# EAGLE design CarBee v1.1 (EAGLE 6.5.0)
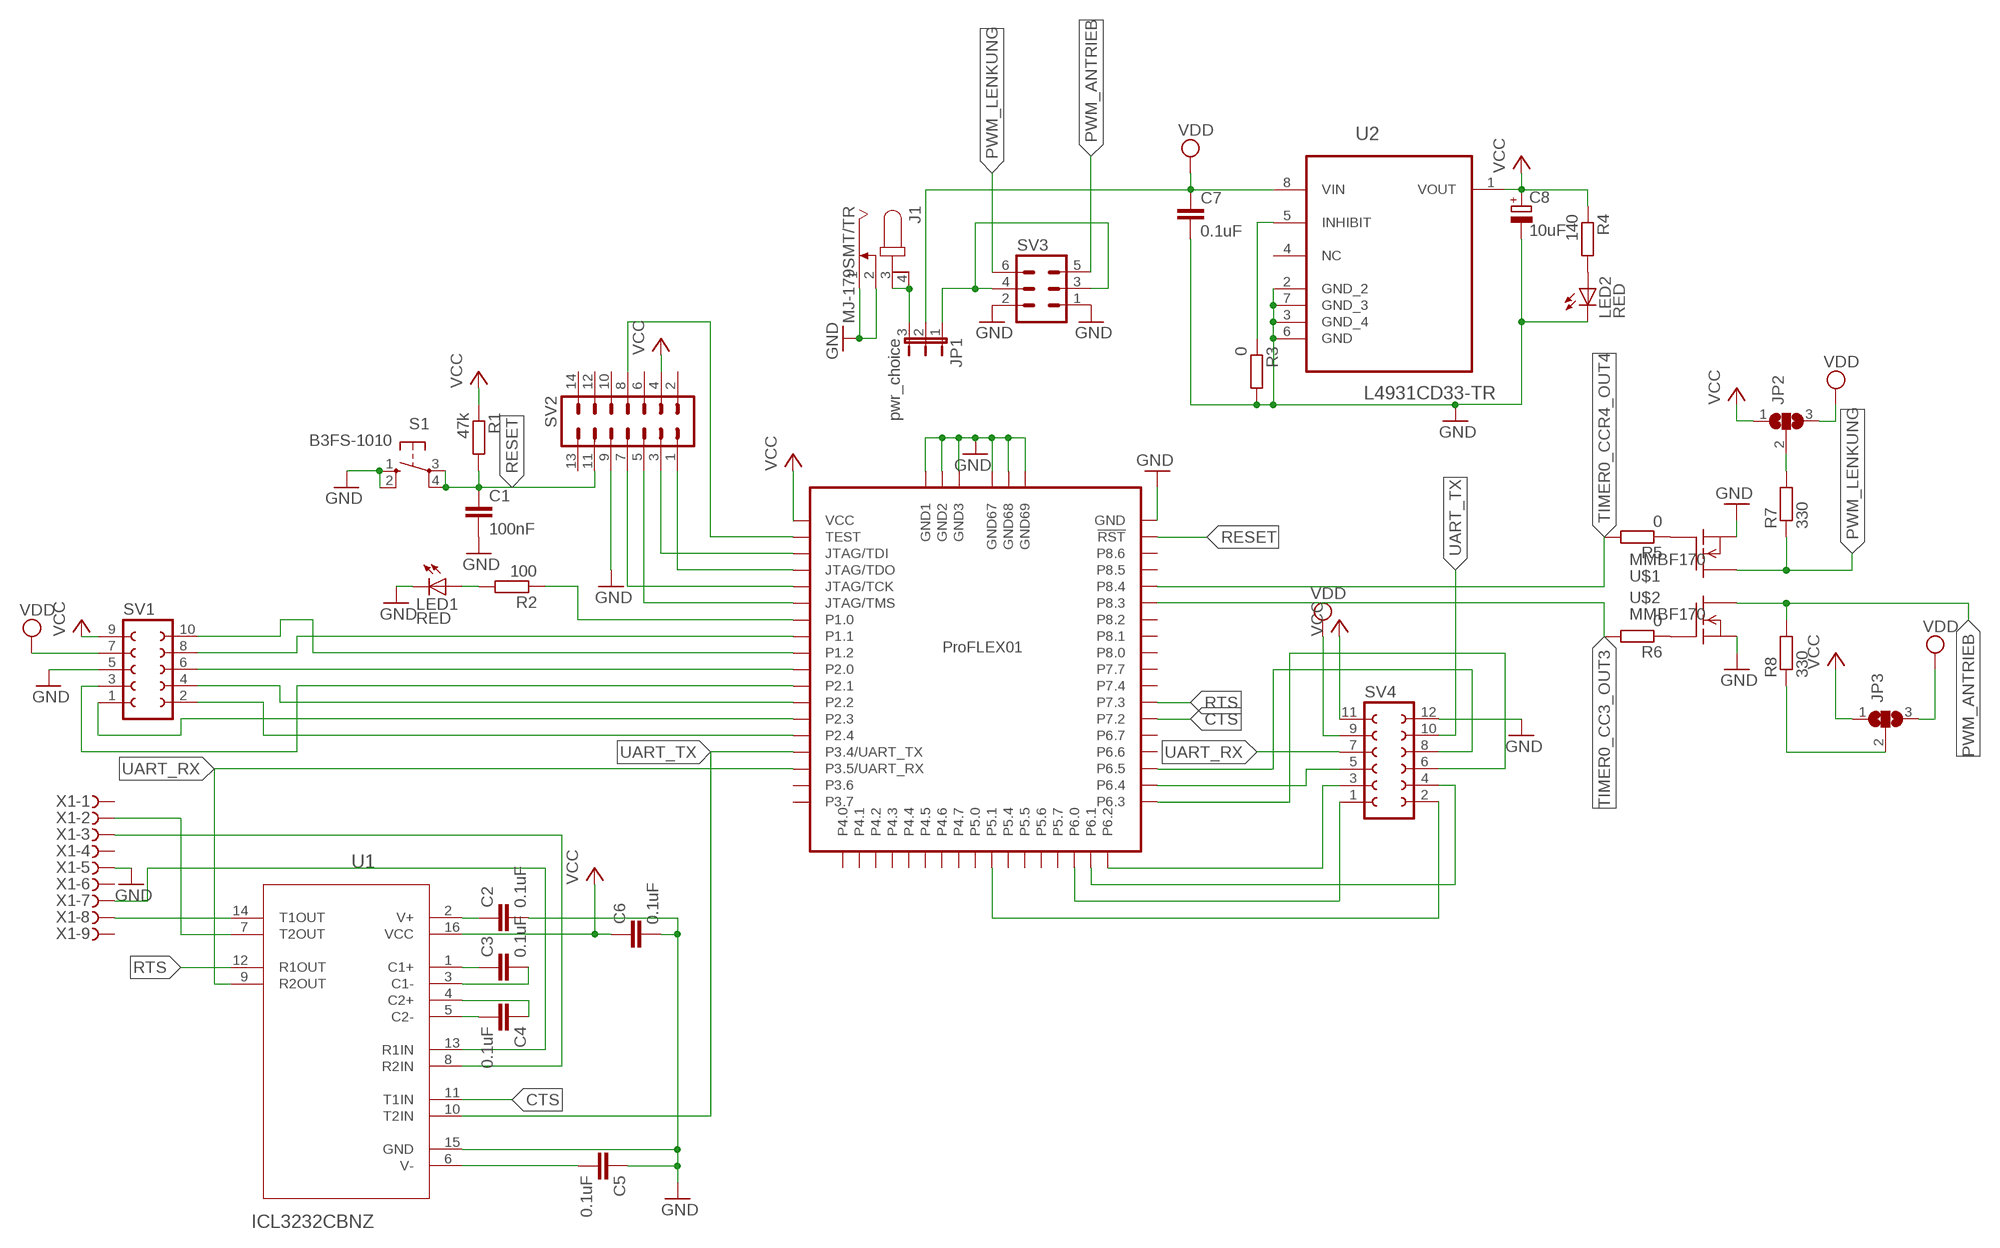
[diagram p0: schematic, sheet 1]

## Parts
C1  100nF  C-EUC0603  [C0603]
C2  0.1uF  C-EUC0603  [C0603]
C3  0.1uF  C-EUC0603  [C0603]
C4  0.1uF  C-EUC0603  [C0603]
C5  0.1uF  C-EUC0603  [C0603]
C6  0.1uF  C-EUC0603  [C0603]
C7  0.1uF  C-EUC0603  [C0603]
C8  10uF  CPOL-EU  [PANASONIC_B]
J1  MJ-179SMT/TR  [MJ-179SMT]
JP1  pwr_choice  JP2E  [JP2]
JP2  SJ2W  [SJ_2]
JP3  SJ2W  [SJ_2]
LED1  RED  LEDCHIP-LED0603  [CHIP-LED0603]
LED2  RED  LEDCHIP-LED0603  [CHIP-LED0603]
MOD1  PROFLEX01  [MODFLEX01]
R1  47k  R-EU_R0603  [R0603]
R2  100  R-EU_R0603  [R0603]
R3  0  R-EU_R0603  [R0603]
R4  140  R-EU_R0603  [R0603]
R5  0  R-EU_R0603  [R0603]
R6  0  R-EU_R0603  [R0603]
R7  330  R-EU_R0603  [R0603]
R8  330  R-EU_R0603  [R0603]
S1  B3FS-1010  [B3FS-1010]
SV1  FE05-2  [FE05-2]
SV2  ML14  [ML14]
SV3  MA03-2  [MA03-2]
SV4  FE06-2  [FE06-2]
U1  ICL3232CBNZ  [SOIC127P600X175-16N]
U2  L4931CD33-TR  [SOIC127P600X175-8N]
U$1  MMBF170  [SOT23]
U$2  MMBF170  [SOT23]
X1  F09HPS  [F09HP]

## Nets
CTS: MOD1.P$37(P7.2) U1.11(T1IN)
GND: C1.2 C2.2 C5.1 C6.2 C7.2 C8.- J1.1 J1.2 LED1.C LED2.C MOD1.P$1(GND1) MOD1.P$2(GND2) MOD1.P$3(GND3) MOD1.P$44(GND) MOD1.P$67(GND67) MOD1.P$68(GND68) MOD1.P$69(GND69) R3.2 S1.1(S) S1.2(S1) SV1.5 SV2.9 SV3.1 SV3.2 SV4.12 U1.15(GND) U2.2(GND_2) U2.3(GND_4) U2.6(GND) U2.7(GND_3) U$1.2(S) U$2.2(S) X1.5
N$1: MOD1.P$13(TEST) SV2.8
N$2: LED2.A R4.2
N$3: MOD1.P$55(P2.4) SV1.2
N$5: MOD1.P$21(P6.4) SV4.5
N$6: MOD1.P$52(P2.1) SV1.3
N$7: U1.8(R2IN) X1.3
N$8: C3.1 U1.1(C1+)
N$9: C3.2 U1.3(C1-)
N$10: MOD1.P$16(P5.1) SV4.2
N$11: C4.1 U1.4(C2+)
N$12: C2.1 U1.2(V+)
N$13: C5.2 U1.6(V-)
N$15: J1.3 J1.4 JP1.3
N$16: JP2.2 R7.2
N$17: MOD1.P$51(P2.0) SV1.6
N$18: MOD1.P$19(P6.2) SV4.3
N$19: MOD1.P$18(P6.1) SV4.4
N$20: MOD1.P$20(P6.3) SV4.6
N$21: MOD1.P$22(P6.5) SV4.8
N$22: MOD1.P$17(P6.0) SV4.1
N$25: MOD1.P$49(P1.0) R2.1
N$26: LED1.A R2.2
N$27: MOD1.P$53(P2.2) SV1.4
N$28: U1.14(T1OUT) X1.8
N$29: MOD1.P$50(P1.1) SV1.8
N$30: U1.13(R1IN) X1.7
N$31: U1.7(T2OUT) X1.2
N$32: MOD1.P$47(P1.2) SV1.10
N$33: JP1.1 SV3.3 SV3.4
N$35: R5.1 U$1.1(G)
N$36: R6.1 U$2.1(G)
N$37: R3.1 U2.5(INHIBIT)
N$51: MOD1.P$54(P2.3) SV1.1
N$59: MOD1.P$12(JTAG/TDO) SV2.1
N$60: MOD1.P$10(JTAG/TDI) SV2.3
N$61: MOD1.P$9(JTAG/TMS) SV2.5
N$62: MOD1.P$11(JTAG/TCK) SV2.7
N$65: C4.2 U1.5(C2-)
N$66: JP3.2 R8.1
PWM_ANTRIEB: R8.2 SV3.5 U$2.3(D)
PWM_LENKUNG: R7.1 SV3.6 U$1.3(D)
RESET: C1.1 MOD1.P$14(!RST) R1.2 S1.3(P) S1.4(P1) SV2.11
RTS: MOD1.P$38(P7.3) U1.12(R1OUT)
TIMER0_CC3_OUT3: MOD1.P$42(P8.3) R6.2
TIMER0_CCR4_OUT4: MOD1.P$41(P8.4) R5.2
UART_RX: MOD1.P$36(P3.5/UART_RX) SV4.7 U1.9(R2OUT)
UART_TX: MOD1.P$35(P3.4/UART_TX) SV4.10 U1.10(T2IN)
VCC: C6.1 C8.+ JP2.1 JP3.1 MOD1.P$26(VCC) R1.1 R4.1 SV1.9 SV2.4 SV4.11 U1.16(VCC) U2.1(VOUT)
VDD: C7.1 JP1.2 JP2.3 JP3.3 SV1.7 SV4.9 U2.8(VIN)
Unconnected: MOD1.P$15(P5.0) MOD1.P$23(P6.6) MOD1.P$24(P6.7) MOD1.P$25(P7.4) MOD1.P$27(P4.7) MOD1.P$28(P4.6) MOD1.P$29(P4.5) MOD1.P$30(P4.4) MOD1.P$31(P4.3) MOD1.P$32(P4.2) MOD1.P$33(P4.1) MOD1.P$34(P4.0) MOD1.P$39(P8.6) MOD1.P$40(P8.5) MOD1.P$43(P8.2) MOD1.P$45(P8.1) MOD1.P$46(P8.0) MOD1.P$48(P7.7) MOD1.P$56(P5.4) MOD1.P$57(P3.7) MOD1.P$58(P5.5) MOD1.P$59(P3.6) MOD1.P$60(P5.7) MOD1.P$61(P5.6) SV2.2 SV2.6 SV2.10 SV2.12 SV2.13 SV2.14 U2.4(NC) X1.1 X1.4 X1.6 X1.9

## Library data of the parts
C1 C3 C6 = rcl:C-EU: CAPACITOR, European symbol; MPN: 0306ZC104KAT2A; OC_NEWARK: 96M1106
C2 C4 C5 C7 = rcl:C-EU: CAPACITOR, European symbol; OC_NEWARK: unknown
C8 = AudioRacer:CPOL-EU; OC_NEWARK: unknown
J1 = AudioRacer:MJ-179SMT/TR: MULTICOMP - MJ-179SMT - BUCHSE LEITERPLATTE SMD PIN 2MM http://de.farnell.com/multicomp/mj-179smt/buchse-leiterplatte-smd-pin-2mm/dp/1737262?Ntt=173-7262 http://www.farnell.com/cad/1174249.pdf http://www.farnell.com/datasheets/1671560.pdf
JP1 = jumper:JP2E: JUMPER; OC_NEWARK: unknown
JP2 JP3 = jumper:SJ2W: SMD solder JUMPER; OC_NEWARK: unknown
LED1 LED2 = led:LED: LED OSRAM: - CHIPLED LG R971, LG N971, LY N971, LG Q971, LY Q971, LO R971, LY R971 LH N974, LH R974 LS Q976, LO Q976, LY Q976 LO Q996 - Hyper CHIPLED LW Q18S LB Q993, LB Q99A, LB R99A - SideLED LS A670, LO A670, LY A670, LG A670, LP A670 LB A673, LV A673, LT A673, LW A673 LH A674 LY A675 LS A676, LA A676, LO A676, LY A676, LW A676 LS A679, LY A679, LG A679 - Hyper Micro SIDELED® LS Y876, LA Y876, LO Y876, LY Y876 LT Y87S - SmartLED LW L88C, LW L88S LB L89C, LB L89S, LG L890 LS L89K, LO L89K, LY L89K LS L896, LA L896, LO L896, LY L896 - TOPLED LS T670, LO T670, LY T670, LG T670, LP T670 LSG T670, LSP T670, LSY T670, LOP T670, LYG T670 LG T671, LOG T671, LSG T671 LB T673, LV T673, LT T673, LW T673 LH T674 LS T676, LA T676, LO T676, LY T676, LB T676, LH T676, LSB T676, LW T676 LB T67C, LV T67C, LT T67C, LS T67K, LO T67K, LY T67K, LW E67C LS E67B, LA E67B, LO E67B, LY E67B, LB E67C, LV E67C, LT E67C LW T67C LS T679, LY T679, LG T679 LS T770, LO T770, LY T770, LG T770, LP T770 LB T773, LV T773, LT T773, LW T773 LH T774 LS E675, LA E675, LY E675, LS T675 LS T776, LA T776, LO T776, LY T776, LB T776 LHGB T686 LT T68C, LB T68C - Hyper Mini TOPLED® LB M676 - Mini TOPLED Santana® LG M470 LS M47K, LO M47K, LY M47K Source: http://www.osram.convergy.de LUXEON: - LUMILED® LXK2-PW12-R00, LXK2-PW12-S00, LXK2-PW14-U00, LXK2-PW14-V00 LXK2-PM12-R00, LXK2-PM12-S00, LXK2-PM14-U00 LXK2-PE12-Q00, LXK2-PE12-R00, LXK2-PE12-S00, LXK2-PE14-T00, LXK2-PE14-U00 LXK2-PB12-K00, LXK2-PB12-L00, LXK2-PB12-M00, LXK2-PB14-N00, LXK2-PB14-P00, LXK2-PB14-Q00 LXK2-PR12-L00, LXK2-PR12-M00, LXK2-PR14-Q00, LXK2-PR14-R00 LXK2-PD12-Q00, LXK2-PD12-R00, LXK2-PD12-S00 LXK2-PH12-R00, LXK2-PH12-S00 LXK2-PL12-P00, LXK2-PL12-Q00, LXK2-PL12-R00 Source: www.luxeon.com KINGBRIGHT: KA-3528ASYC Source: www.kingbright.com; OC_NEWARK: unknown
MOD1 = proflex01:PROFLEX01; OC_NEWARK: unknown
R1-R8 = rcl:R-EU_: RESISTOR, European symbol; OC_NEWARK: unknown
S1 = AudioRacer:B3FS-1010: B3FS-1010 http://www.components.omron.com/components/web/PDFLIB.nsf/0/7A04F73D25AF4A8785257201007DD542/$file/B3FS_1110.pdf
SV1 = con-lsta:FE05-2: FEMALE HEADER; OC_FARNELL: unknown; OC_NEWARK: unknown
SV2 = con-harting-ml:ML14: HARTING; OC_FARNELL: unknown; OC_NEWARK: unknown
SV3 = con-lstb:MA03-2: PIN HEADER; OC_FARNELL: unknown; OC_NEWARK: unknown
SV4 = con-lsta:FE06-2: FEMALE HEADER; OC_FARNELL: unknown; OC_NEWARK: unknown
U1 = AudioRacer:ICL3232CBNZ: RS-232 Transmitters/Receivers; MPN: ICL3232CBNZ; OC_FARNELL: 9663975; OC_NEWARK: 80K7124; PACKAGE: SOIC-16; SUPPLIER: INTERSIL
U2 = AudioRacer:L4931CD33-TR: Very low drop voltage regulators with inhibit; MPN: L4931CD33-TR; OC_FARNELL: 1094211; OC_NEWARK: 89K1316; PACKAGE: SOIC-8; SUPPLIER: STMICROELECTRONICS
U$1 U$2 = AudioRacer:MMBF170: FAIRCHILD SEMICONDUCTOR - MMBF170 - TRANSISTOR MOSFET SMD SOT 23 N KANAL http://de.farnell.com/fairchild-semiconductor/mmbf170/transistor-mosfet-smd-sot-23-n/dp/9845399?Ntt=984-5399 http://www.farnell.com/datasheets/694801.pdf
X1 = con-subd:F09?S: SUB-D; OC_FARNELL: unknown; OC_NEWARK: unknown

## Net classes
1 SRV_PWR: width 3.988 mm

## Board
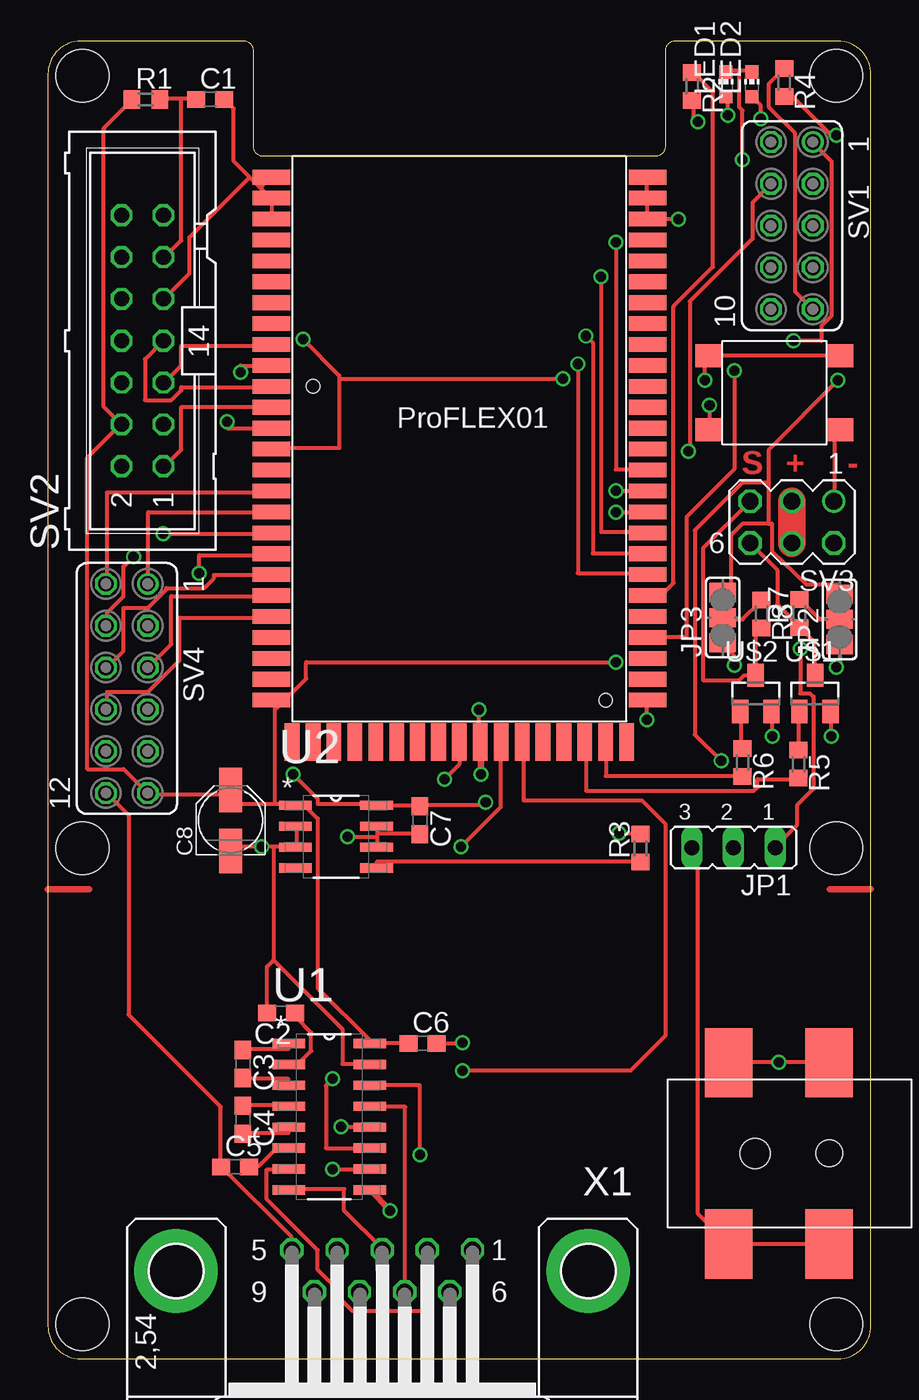
[diagram p1: board, top side]
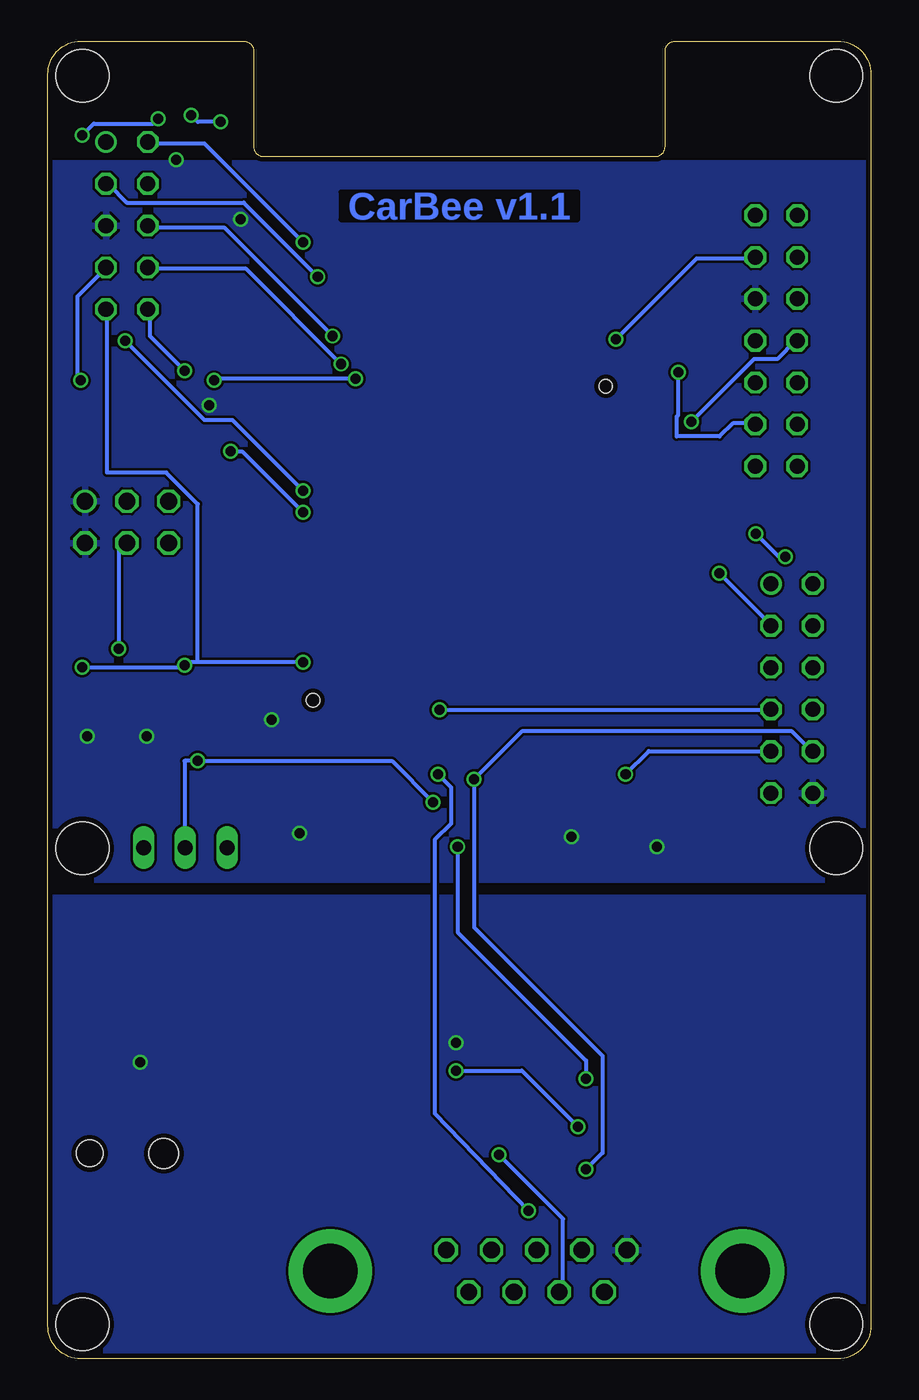
[diagram p2: board, bottom side, seen from below]

Size 50 x 80 mm. Coordinates in mm from the lower left corner, seen from the top.
Outline: 0,78 0,2 arc90 2,0 48,0 arc90 50,2 50,78 arc90 48,80 38.1,80 arc90 37.5,79.4 37.5,73.6 arc-90 36.9,73 13.1,73 arc-90 12.5,73.6 12.5,79.4 arc90 11.9,80 2,80 arc90 0,78
Copper layers (1*16): Top 0.035mm / dielectric 1.5mm / Bottom 0.035mm
Design rules "PCB-POOL Standard": minimum track width 0.15mm, minimum drill 0.3mm, track to track 0.15mm, track to pad 0.15mm, pad to pad 0.15mm, via to via 0.15mm, smd to smd 0.15mm, copper to edge 0.3mm, drill to drill 0.2mm, minimum pad ring 0.2mm, minimum via ring 0.15mm, stop-mask expansion 0.075mm, vias tented up to drill 0mil, thermal gap 0.2mm
Holes 3.2 mm at 47.9,77.9 2.1,77.9 47.9,2.1 2.1,2.1 47.9,31 2.1,31
tKeepout: 2 lines
bKeepout: 2 lines

### Footprints (pad centres in the part's own frame; a part is rotated, then mirrored left to right if it is on the bottom)
C0603 = smd 1.1 x 1: 1 -0.85,0; 2 0.85,0
PANASONIC_B = smd 2.7 x 1.4: + 1.85,0; - -1.85,0
MJ-179SMT = smd 2.9 x 4.2: 1 3.56,-5.5; 2 -2.54,-5.5; 3 3.56,5.5; 4 -2.54,5.5 | hole 1.6: -2.54,0 | hole 1.8: 1.96,0
JP2 = drill 0.914 long: 1 -2.54,0; 2 0,0; 3 2.54,0
SJ_2 = smd 1.168 x 1.6: 1 -1.524,0; 2 0,0; 3 1.524,0
CHIP-LED0603 = smd 0.8 x 0.8: A 0,-0.75; C 0,0.75
MODFLEX01 = smd 2.286 x 0.889: P$1 -11.43,16.51; P$2 -11.43,15.24; P$3 -11.43,13.97; P$4 -11.43,12.7; P$5 -11.43,11.43; P$6 -11.43,10.16; P$7 -11.43,8.89; P$8 -11.43,7.62; P$9 -11.43,6.35; P$10 -11.43,5.08; P$11 -11.43,3.81; P$12 -11.43,2.54; P$13 -11.43,1.27; P$14 -11.43,0; P$15 -11.43,-1.27; P$16 -11.43,-2.54; P$17 -11.43,-3.81; P$18 -11.43,-5.08; P$19 -11.43,-6.35; P$20 -11.43,-7.62; P$21 -11.43,-8.89; P$22 -11.43,-10.16; P$23 -11.43,-11.43; P$24 -11.43,-12.7; P$25 -11.43,-13.97; P$26 -11.43,-15.24; P$44 11.43,-15.24; P$45 11.43,-13.97; P$46 11.43,-12.7; P$47 11.43,-11.43; P$48 11.43,-10.16; P$49 11.43,-8.89; P$50 11.43,-7.62; P$51 11.43,-6.35; P$52 11.43,-5.08; P$53 11.43,-3.81; P$54 11.43,-2.54; P$55 11.43,-1.27; P$56 11.43,0; P$57 11.43,1.27; P$58 11.43,2.54; P$59 11.43,3.81; P$60 11.43,5.08; P$61 11.43,6.35; P$62 11.43,7.62; P$63 11.43,8.89; P$64 11.43,10.16; P$65 11.43,11.43; P$66 11.43,12.7; P$67 11.43,13.97; P$68 11.43,15.24; P$69 11.43,16.51 | smd 0.889 x 2.286: P$27 -10.16,-17.78; P$28 -8.89,-17.78; P$29 -7.62,-17.78; P$30 -6.35,-17.78; P$31 -5.08,-17.78; P$32 -3.81,-17.78; P$33 -2.54,-17.78; P$34 -1.27,-17.78; P$35 0,-17.78; P$36 1.27,-17.78; P$37 2.54,-17.78; P$38 3.81,-17.78; P$39 5.08,-17.78; P$40 6.35,-17.78; P$41 7.62,-17.78; P$42 8.89,-17.78; P$43 10.16,-17.78 | hole 0.8: 8.89,-15.24; -8.89,3.81
R0603 = smd 1 x 1.1: 1 -0.85,0; 2 0.85,0
B3FS-1010 = smd 1.6 x 1.4: 1 4,-2.25; 2 -4,-2.25; 3 4,2.25; 4 -4,2.25
FE05-2 = drill 0.914: 1 -5.08,1.27 | drill 0.914 octagon: 2 -5.08,-1.27; 3 -2.54,1.27; 4 -2.54,-1.27; 5 0,1.27; 6 0,-1.27; 7 2.54,1.27; 8 2.54,-1.27; 9 5.08,1.27; 10 5.08,-1.27
ML14 = drill 0.914 octagon: 1 -7.62,-1.27; 2 -7.62,1.27; 3 -5.08,-1.27; 4 -5.08,1.27; 5 -2.54,-1.27; 6 -2.54,1.27; 7 0,-1.27; 8 0,1.27; 9 2.54,-1.27; 10 2.54,1.27; 11 5.08,-1.27; 12 5.08,1.27; 13 7.62,-1.27; 14 7.62,1.27
MA03-2 = drill 1.016: 1 -2.54,-1.27 | drill 1.016 octagon: 2 -2.54,1.27; 3 0,-1.27; 4 0,1.27; 5 2.54,-1.27; 6 2.54,1.27
FE06-2 = drill 0.914: 1 -6.35,1.27 | drill 0.914 octagon: 2 -6.35,-1.27; 3 -3.81,1.27; 4 -3.81,-1.27; 5 -1.27,1.27; 6 -1.27,-1.27; 7 1.27,1.27; 8 1.27,-1.27; 9 3.81,1.27; 10 3.81,-1.27; 11 6.35,1.27; 12 6.35,-1.27
SOIC127P600X175-16N = smd 1.981 x 0.559: 1 -2.464,4.445; 2 -2.464,3.175; 3 -2.464,1.905; 4 -2.464,0.635; 5 -2.464,-0.635; 6 -2.464,-1.905; 7 -2.464,-3.175; 8 -2.464,-4.445; 9 2.464,-4.445; 10 2.464,-3.175; 11 2.464,-1.905; 12 2.464,-0.635; 13 2.464,0.635; 14 2.464,1.905; 15 2.464,3.175; 16 2.464,4.445
SOIC127P600X175-8N = smd 1.981 x 0.559: 1 -2.464,1.905; 2 -2.464,0.635; 3 -2.464,-0.635; 4 -2.464,-1.905; 5 2.464,-1.905; 6 2.464,-0.635; 7 2.464,0.635; 8 2.464,1.905
SOT23 = smd 1 x 1.4: 1 -0.95,-1.1; 2 0.95,-1.1; 3 0,1.1
F09HP = drill 1.016 octagon: 1 -5.486,-1.27; 2 -2.743,-1.27; 3 0,-1.27; 4 2.743,-1.27; 5 5.486,-1.27; 6 -4.115,1.27; 7 -1.372,1.27; 8 1.372,1.27; 9 4.115,1.27 | drill 3.302 pad 5.08: G1 -12.522,0; G2 12.522,0

### Placement (x,y rotation side)
C1  9.86,76.46 0 top
C2  14.16,21 180 top
C3  11.85,17.9 270 top
C4  11.86,14.51 270 top
C5  11.38,11.65 0 top
C6  22.77,19.15 0 top
C7  22.6,32.7 270 top
C8  11.1,32.69 90 top
J1  44.92,12.47 180 top
JP1  41.65,31.04 180 top
JP2  48.1,44.9 90 top
JP3  41,45 90 top
LED1  41.18,77.38 0 top
LED2  42.76,77.38 0 top
MOD1  25,55.23 0 top
R1  5.95,76.46 0 top
R2  39.13,77.26 270 top
R3  36,31 90 top
R4  44.73,77.48 270 top
R5  45.6,36.1 270 top
R6  42.2,36.2 270 top
R7  45.65,45.25 90 top
R8  43.35,45.23 270 top
S1  44.14,58.65 0 top
SV1  45.2,68.8 270 top
SV2  5.75,61.81 90 top
SV3  45.2,50.8 180 top
SV4  4.8,40.7 270 top
U1  17.1,14.7 0 top
U2  17.5,31.7 0 top
U$1  46.6,40.4 0 top
U$2  43,40.4 0 top
X1  20.31,5.33 180 top

### Tracks (layer width: path | path; a pad name or v marks a point on that pad's centre or on a via)
CTS  (via drill 0.61)
  Top 0.254: v17.3,17 16.9,16.6 16.9,12.8 19.5,12.8 U1.11 | v25.1,31.1 27.5,33.5 27.5,37.4 MOD1.P$37
  Bottom 0.254: v17.3,17 17.3,18.1 25.1,25.9 v25.1,31.1
GND  (via drill 0.61)
  Top 0.254: J1.1 41.4,18 v44.4,18 47.4,18 J1.2 | X1.5 14.8,6.6 14.8,7.4 10.6,11.6 C5.1 10.5,11.7 10.5,15.3 4.9,20.9 4.9,33 3.6,34.3 SV4.12 | 20,31.9 22.6,31.9 C7.2 | 20,31.9 20,32.3 U2.7 | 20,31.9 20,31.8 20,31.7 | 20,31.7 20,31.1 U2.6 19.9,31 | 19.6,17.8 U1.15 19.5,17.9 17.9,17.9 17.9,20 13.7,24.2 | U2.2 15.1,32.3 15.1,31.1 U2.3 15,31.1 13.7,31.1 | 13.7,31.1 v13,31.1 11.1,31.1 C8.- | 13.7,31.1 13.7,24.2 | 12.95,71.05 13.5,70.5 MOD1.P$2 13.6,70.4 13.6,69.2 MOD1.P$3 | 12.95,71.05 12.25,71.75 | 12.25,71.75 11.3,72.7 11.3,75.9 10.8,76.4 C1.2 | MOD1.P$1 13.5,71.7 13,71.2 13,71.1 12.95,71.05 | MOD1.P$69 36.4,71.7 36.4,70.5 MOD1.P$68 36.4,70.4 36.4,69.2 MOD1.P$67 v38.3,69.2 | 42,78.2 42.7,78.2 LED2.C | 42,78.2 41.2,78.2 LED1.C | v34.7,31.9 36,31.9 R3.2 | 42,78.2 42,76 42.2,75.8 v42.2,72.8 | v44,37.8 44,39.3 U$2.2 | v47.6,37.8 47.6,39.3 U$1.2 | v40.2,57.9 40.2,56.4 S1.2 | S1.1 48.1,56.4 47.8,56.1 47.8,52.1 SV3.1 | v36.4,38.8 36.4,39.9 MOD1.P$44 | 12.25,71.75 8.6,68.1 8.6,65.9 7.1,64.4 SV2.9 | C2.2 13.31,23.81 13.7,24.2 | C6.2 25.2,19.15 v25.2,19.2 | v18.2,31.7 20,31.7
  Bottom 0.254: v42.2,72.8 42.2,72.6
  pour Bottom: -2.3,72.6 51.1,72.6 51.1,29.1 -2.3,29.1
  pour Bottom: -2.3,28 53.7,28 53.7,-14.7 -2.3,-14.7
N$1  (via drill 0.61)
  Top 0.254: MOD1.P$13 10.9,56.5 v10.9,56.9
  Bottom 0.254: v10.9,56.9 7.1,60.7 5.7,60.7 4.6,61.8 4.5,61.8 SV2.8
N$2  (via drill 0.61)
  Top 0.254: v43.3,75.3 43.3,76.1 42.8,76.6 LED2.A | v47.9,74.3 47.6,74.3 45.3,76.6 44.8,76.6 R4.2
  Bottom 0.254: v43.3,75.3 43.6,75 47.2,75 v47.9,74.3
N$3  (via drill 0.61)
  Top 0.254: v34.5,67.8 34.5,54 36.4,54 MOD1.P$55
  Bottom 0.254: v34.5,67.8 40.5,73.8 43.9,73.8 SV1.2
N$5
  Top 0.254: SV4.5 7.5,43.4 7.5,46.3 13.5,46.3 MOD1.P$21
N$6  (via drill 0.61)
  Top 0.254: v33.6,65.7 33.6,50.2 36.4,50.2 MOD1.P$52
  Bottom 0.254: v33.6,65.7 38.1,70.2 45.2,70.2 46.3,71.3 46.4,71.3 SV1.3
N$7
  Top 0.254: U1.8 14.7,10.3 18,10.3 18,9 20.3,6.7 X1.3
N$8
  Top 0.254: C3.1 11.9,18.8 14.6,18.8 14.6,19.1 U1.1
N$9
  Top 0.254: C3.2 11.9,17 14.6,17 14.6,16.7 U1.3
N$10
  Top 0.254: MOD1.P$16 13.5,52.6 3.6,52.6 3.6,47.1 SV4.2
N$11
  Top 0.254: C4.1 11.9,15.4 14.6,15.4 U1.4
N$12
  Top 0.254: U1.2 14.7,17.9 15.2,17.9 16,18.7 16,19.8 15.01,20.79 C2.1
N$13
  Top 0.254: C5.2 12.3,11.7 12.8,11.7 13.8,12.7 14.6,12.7 U1.6
N$15
  Top 0.254: JP1.3 39.2,31 39.5,30.7 39.5,8.8 41.3,7 J1.3 41.4,7 47.4,7 J1.4
N$16
  Top 0.254: JP2.2 46.9,44.9 45.7,46.1 R7.2
N$17  (via drill 0.61)
  Top 0.254: v32.7,62.1 33.1,61.7 33.1,48.9 36.4,48.9 MOD1.P$51
  Bottom 0.254: v32.7,62.1 39.3,68.7 43.8,68.7 43.9,68.8 SV1.6
N$18  (via drill 0.61)
  Top 0.254: v9.2,47.7 9.2,48.8 13.5,48.8 MOD1.P$19
  Bottom 0.254: v9.2,47.7 6.1,44.6 SV4.3
N$19  (via drill 0.61)
  Top 0.254: v7,50.1 13.5,50.1 MOD1.P$18 | v5.2,48.7 4.6,48.1 4.6,46.3 3.6,45.3 3.6,44.6 SV4.4
  Bottom 0.254: v7,50.1 5.6,48.7 v5.2,48.7
N$20
  Top 0.254: MOD1.P$20 13.5,47.6 10.1,47.6 10.1,47.4 9.5,46.8 7.2,46.8 7.2,46.7 6.1,45.6 4.6,45.6 4.6,43 3.6,42 SV4.6
N$21
  Top 0.254: MOD1.P$22 13.5,45 8,45 8,42.4 6.1,40.5 3.6,40.5 3.6,39.5 SV4.8
N$22
  Top 0.254: MOD1.P$17 13.5,51.4 6.1,51.4 6.1,47.1 SV4.1
N$25
  Top 0.254: R2.1 39.2,78.1 40.4,76.9 40.4,66.3 38,63.9 38,47.1 37.3,46.4 36.5,46.4 MOD1.P$49
N$26  (via drill 0.61)
  Top 0.254: v41.3,75.5 41.3,76.5 41.2,76.6 LED1.A | v39.5,75.1 39.2,75.4 39.2,76.4 R2.2
  Bottom 0.254: v41.3,75.5 40.9,75.1 v39.5,75.1
N$27  (via drill 0.61)
  Top 0.254: v34.5,51.4 36.4,51.4 MOD1.P$53 | v38.9,55.1 39,55.2 39,64.2 42.8,68 42.8,70.2 43.9,71.3 SV1.4
  Bottom 0.254: v34.5,51.4 38.2,55.1 v38.9,55.1
N$28  (via drill 0.61)
  Top 0.254: v22.6,12.4 22.6,16.6 19.6,16.6 U1.14
  Bottom 0.254: v22.6,12.4 18.7,8.5 18.7,4.1 18.9,4.1 X1.8
N$29  (via drill 0.61)
  Top 0.254: v32.2,60.4 32.2,47.7 36.4,47.7 MOD1.P$50
  Bottom 0.254: v32.2,60.4 38,66.2 43.9,66.2 SV1.8
N$30
  Top 0.254: U1.13 19.6,15.3 21.7,15.3 21.7,4.1 X1.7
N$31
  Top 0.254: U1.7 14.6,11.5 13.3,11.5 13.3,9.7 16.4,6.6 16.4,5.4 17.8,4 17.8,3.6 18.5,2.9 23,2.9 23,6.6 X1.2
N$32  (via drill 0.61)
  Top 0.254: MOD1.P$47 38.8,43.8 38.8,51.1 41.7,54 v41.7,60
  Bottom 0.254: v41.7,60 43.8,62.1 43.8,63.7 43.9,63.7 SV1.10
N$33  (via drill 0.61)
  Top 0.254: v45.7,43.1 45.7,40.4 46.3,40.4 46.5,40.2 46.5,34.6 45.5,33.6 45.5,32.4 44.2,31.1 JP1.1
  Top 1.676: SV3.4 SV3.3
  Bottom 0.254: v45.7,43.1 45.7,49.5 45.2,49.5 SV3.4
N$34
  Top 0.406: 0,28.5 2.5,28.5
N$35
  Top 0.254: R5.1 45.6,39.3 U$1.1
N$36
  Top 0.254: R6.1 42.2,37.1 42.1,37.2 42.1,39.3 U$2.1
N$37
  Top 0.254: R3.1 36,30.2 20,30.2 20,29.8 U2.5
N$51  (via drill 0.61)
  Top 0.254: v34.5,52.7 36.4,52.7 MOD1.P$54 | v45.3,61.8 47,61.8 47,62.7 47.6,63.3 47.6,72.7 46.5,73.8 SV1.1
  Bottom 0.254: v34.5,52.7 38.8,57 40.5,57 v45.3,61.8
N$58
  Top 0.406: 47.5,28.5 50,28.5
N$59
  Top 0.254: MOD1.P$12 13.5,57.8 8.1,57.8 8.1,55.2 7.1,54.2 SV2.1
N$60  (via drill 0.61)
  Top 0.254: v11.7,59.9 11.7,60.3 13.5,60.3 MOD1.P$10
  Bottom 0.254: v11.7,59.9 11.7,57.3 11.8,57.2 11.8,56 9.2,56 8.4,56.8 7.1,56.8 SV2.3
N$61
  Top 0.254: MOD1.P$9 13.5,61.5 8.1,61.5 8.1,60.3 7.1,59.3 SV2.5
N$62
  Top 0.254: MOD1.P$11 13.5,59 8.1,59 8.1,58.8 7.5,58.2 5.9,58.2 5.9,60.7 7,61.8 SV2.7
N$65
  Top 0.254: C4.2 11.9,13.7 14.6,13.7 14.6,14 U1.5
N$66
  Top 0.254: JP3.2 41,44.9 42.2,44.9 43.3,46 R8.1
PWM_ANTRIEB
  Top 0.254: R8.2 43.3,44.3 43,44 U$2.3 42.3,41.5 42,41.2 39.8,41.2 39.8,49.2 42.6,52 SV3.5
PWM_LENKUNG
  Top 0.254: U$1.3 46.6,43.5 45.7,44.4 R7.1 45.6,44.5 44.3,45.8 44.3,47.9 42.7,49.5 SV3.6
RESET  (via drill 0.61)
  Top 0.254: S1.3 S1.4 40.1,60.8 39.9,60.6 v39.9,59.4 | 8.1,76.5 9,76.5 C1.1 | 8.1,76.5 6.8,76.5 R1.2 | 8.1,76.5 8.1,67.9 7.1,66.9 SV2.11 | 17.7,59.5 17.7,59.7 v15.5,61.9 | 17.7,59.5 17.7,55.3 13.6,55.3 MOD1.P$14 | 17.7,59.5 v31.3,59.5
  Bottom 0.254: v15.5,61.9 10.6,66.8 7.1,66.8 SV2.11 | v39.9,59.4 39.8,59.5 v31.3,59.5
RTS  (via drill 0.61)
  Top 0.254: v17.8,14.1 19.5,14.1 U1.12 | v25.2,17.5 35.4,17.5 37.5,19.6 37.5,32.5 36.1,33.9 28.9,33.9 28.9,37.4 MOD1.P$38
  Bottom 0.254: v17.8,14.1 21.2,17.5 v25.2,17.5
TIMER0_CC3_OUT3
  Top 0.254: R6.2 42.2,35.4 33.9,35.4 33.9,37.4 MOD1.P$42
TIMER0_CCR4_OUT4
  Top 0.254: R5.2 45.6,35.2 43.1,35.2 43.1,34.7 42.9,34.5 32.7,34.5 32.7,37.4 MOD1.P$41
UART_RX  (via drill 0.61)
  Top 0.254: 26.2,37.45 v26.2,39.4
  Top 0.406: 26.2,37.45 MOD1.P$36 26.3,37.45 v26.3,35.5 | v20.8,9 20.8,9.02 U1.9
  Bottom 0.254: v26.2,39.4 6.07,39.4 | v26.3,35.5 25.5,34.7 25.5,32.5 26.5,31.5 26.5,14.9 v20.8,9
  Bottom 0.406: 6.07,39.4 SV4.7
UART_TX  (via drill 0.61)
  Top 0.254: MOD1.P$35 25,36.1 v24.1,35.2 | v17.3,11.5 19.54,11.5 U1.10
  Bottom 0.254: v17.3,11.5 16.3,12.5 16.3,18.4 24.1,26.2 v24.1,35.2 21.2,38.1 4.8,38.1 3.59,36.89 SV4.10
VCC  (via drill 0.61)
  Top 0.254: R1.1 5.1,76.4 3.4,74.7 3.4,57.8 4.4,56.8 SV2.4 4.4,56.7 2.4,54.7 2.4,35.8 4.6,35.8 6,34.4 SV4.11 | R4.1 43.8,77.4 43.8,76 45.4,74.4 45.4,64.8 46.4,63.8 SV1.9 | v41.7,42.1 41.7,42.7 41,43.4 JP3.1 | v47.9,42 48.1,42.2 JP2.1 | 21.9,19.2 C6.1 21.92,19.2 19.6,19.2 U1.16 19.6,19.3 16.4,22.5 16.4,32.8 15.7,33.5 15.1,33.5 U2.1 15,33.7 13.8,33.7 | 11.1,33.7 13.8,33.7 | 13.8,33.7 13.8,39.5 | 13.8,39.5 13.8,39.7 13.6,39.9 MOD1.P$26 | 11,33.8 C8.+ 11.1,34.29 6.07,34.29 | v34.5,42.3 15.7,42.3 15.7,41.3 13.9,39.5 13.8,39.5
  Top 0.406: C8.+ 10.8,34.3 10.8,34.29 | 6.07,34.29 SV4.11 | 11,33.8 11.1,33.8 11.1,33.7
  Bottom 0.254: v47.9,42 41.8,42 v41.7,42.1 41.6,42.1 41.4,42.3 40.9,42.3 | v34.5,42.3 40.9,42.3 | 40.9,42.3 40.9,51.9 42.8,53.8 46.4,53.8 46.4,63.7 SV1.9
VDD  (via drill 0.61)
  Top 0.254: v14.9,35.5 16.4,34 16.4,33.7 19.9,33.7 U2.8 20,33.6 22.6,33.6 C7.1 22.7,33.6 26.6,33.6 v26.6,33.8 | 43.8,50.7 44,50.7 44,49 46.1,47 48.1,47 JP2.3 | 43.8,50.7 42.2,50.7 41.5,50 41.5,47.1 41,46.6 JP3.3 | v40.9,36.3 39.3,37.9 39.3,50.3 42.2,53.2 43.8,53.2 | 43.8,50.7 43.8,53.2 | v48,59.4 43.8,55.2 43.8,53.2
  Bottom 0.254: JP1.2 41.7,31.1 41.7,36.3 v40.9,36.3 29.1,36.3 v26.6,33.8 | v48,59.4 48.2,59.4 48.2,64.5 46.5,66.2 SV1.7 | v14.9,35.5 13.5,36.9 SV4.9

### Text on the board
Top: S | + | -
Bottom: CarBee v1.1